# Altium project 智能车_电磁PCB.PrjPcb
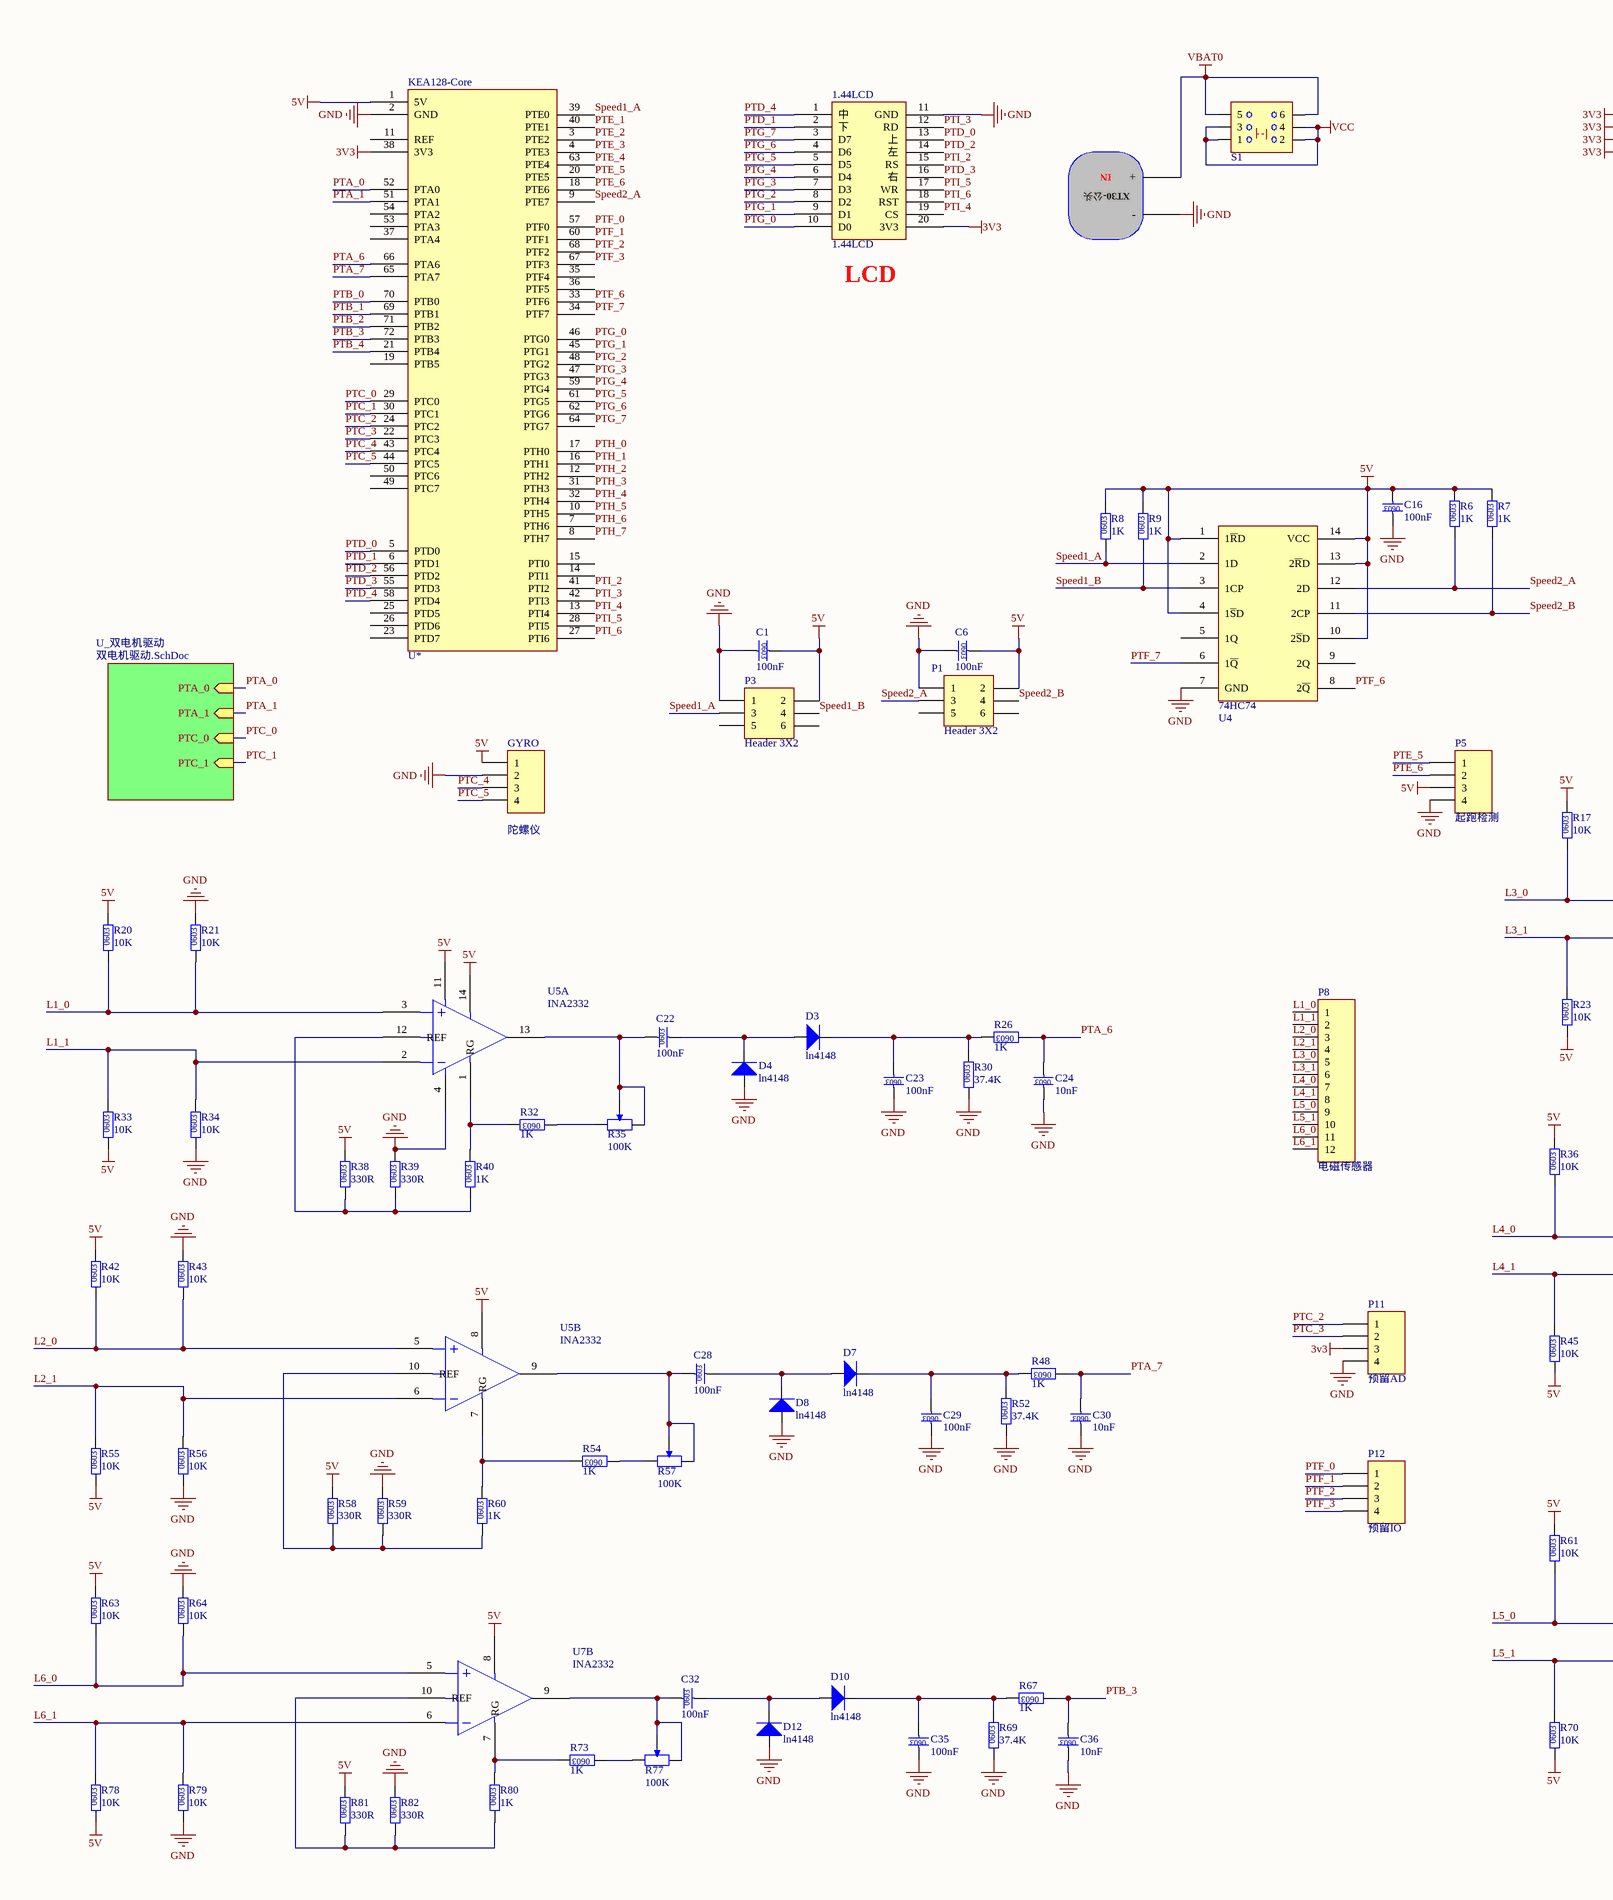
[diagram p0: 电磁PCB.SchDoc, left]
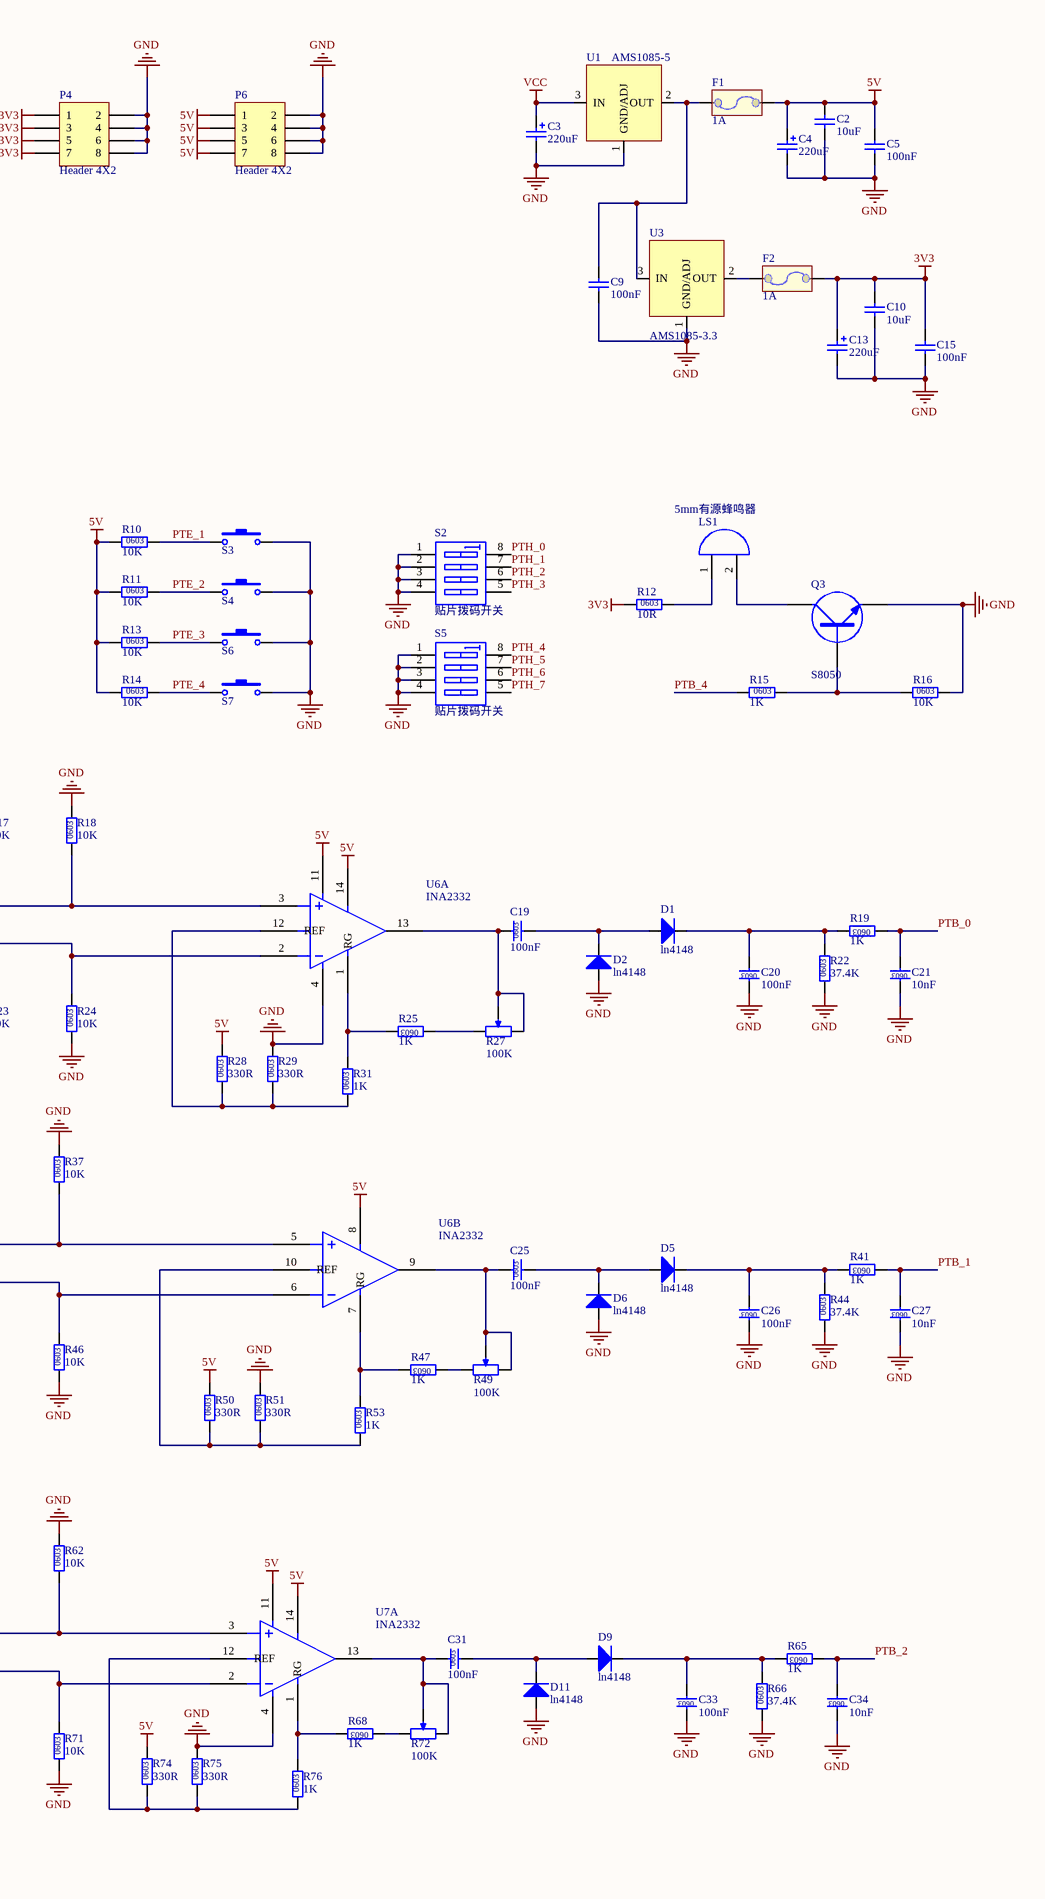
[diagram p1: 电磁PCB.SchDoc, right]
2 sheets, 209 parts. Net scope: hierarchical (ports join the sheet entries above them; power ports are global).
Board file: 电磁PCB.PcbDoc
Sheets:
  电磁PCB.SchDoc
    U_双电机驱动 = 双电机驱动.SchDoc

## Sheet 电磁PCB.SchDoc
size A2

### Parts
1.44LCD  1.44LCD  [1.44LCD]
C1  100nF  [0603C]
C2  10uF  [0805]
C3  220uF  [AEC_D6.3]
C4  220uF  [AEC_D6.3]
C5  100nF  [0805]
C6  100nF  [0603C]
C9  100nF  [0805]
C10  10uF  [0805]
C13  220uF  [AEC_D6.3]
C15  100nF  [0805]
C16  100nF  [0603C]
C19  100nF  [0603C]
C20  100nF  [0603C]
C21  10nF  [0603C]
C22  100nF  [0603C]
C23  100nF  [0603C]
C24  10nF  [0603C]
C25  100nF  [0603C]
C26  100nF  [0603C]
C27  10nF  [0603C]
C28  100nF  [0603C]
C29  100nF  [0603C]
C30  10nF  [0603C]
C31  100nF  [0603C]
C32  100nF  [0603C]
C33  100nF  [0603C]
C34  10nF  [0603C]
C35  100nF  [0603C]
C36  10nF  [0603C]
D1  ln4148  [SOD-523(0603)]
D2  ln4148  [SOD-523(0603)]
D3  ln4148  [SOD-523(0603)]
D4  ln4148  [SOD-523(0603)]
D5  ln4148  [SOD-523(0603)]
D6  ln4148  [SOD-523(0603)]
D7  ln4148  [SOD-523(0603)]
D8  ln4148  [SOD-523(0603)]
D9  ln4148  [SOD-523(0603)]
D10  ln4148  [SOD-523(0603)]
D11  ln4148  [SOD-523(0603)]
D12  ln4148  [SOD-523(0603)]
F1  1A  [1206]
F2  1A  [1206]
GYRO  陀螺仪  [HDR1X4]
KEA128-Core  U*  [山外KEA核心板]
LS1  Bell  [BELL]  (value not drawn)
P1  Header 3X2  [HDR2X3]
P2  XT30-公-pcb  [XT30-垂直]  (value not drawn)
P3  Header 3X2  [HDR2X3]
P4  Header 4X2  [HDR2X4]
P5  起跑检测  [HDR1X4]
P6  Header 4X2  [HDR2X4]
P8  电磁传感器  [HDR1X12]
P11  预留AD  [HDR1X4]
P12  预留IO  [HDR1X4]
Q3  S8050  [SOT-23]
R6  1K  [0603R]
R7  1K  [0603R]
R8  1K  [0603R]
R9  1K  [0603R]
R10  10K  [0603R]
R11  10K  [0603R]
R12  10R  [0603R]
R13  10K  [0603R]
R14  10K  [0603R]
R15  1K  [0603R]
R16  10K  [0603R]
R17  10K  [0603R]
R18  10K  [0603R]
R19  1K  [0603R]
R20  10K  [0603R]
R21  10K  [0603R]
R22  37.4K  [0603R]
R23  10K  [0603R]
R24  10K  [0603R]
R25  1K  [0603R]
R26  1K  [0603R]
R27  100K  [3362P]
R28  330R  [0603R]
R29  330R  [0603R]
R30  37.4K  [0603R]
R31  1K  [0603R]
R32  1K  [0603R]
R33  10K  [0603R]
R34  10K  [0603R]
R35  100K  [3362P]
R36  10K  [0603R]
R37  10K  [0603R]
R38  330R  [0603R]
R39  330R  [0603R]
R40  1K  [0603R]
R41  1K  [0603R]
R42  10K  [0603R]
R43  10K  [0603R]
R44  37.4K  [0603R]
R45  10K  [0603R]
R46  10K  [0603R]
R47  1K  [0603R]
R48  1K  [0603R]
R49  100K  [3362P]
R50  330R  [0603R]
R51  330R  [0603R]
R52  37.4K  [0603R]
R53  1K  [0603R]
R54  1K  [0603R]
R55  10K  [0603R]
R56  10K  [0603R]
R57  100K  [3362P]
R58  330R  [0603R]
R59  330R  [0603R]
R60  1K  [0603R]
R61  10K  [0603R]
R62  10K  [0603R]
R63  10K  [0603R]
R64  10K  [0603R]
R65  1K  [0603R]
R66  37.4K  [0603R]
R67  1K  [0603R]
R68  1K  [0603R]
R69  37.4K  [0603R]
R70  10K  [0603R]
R71  10K  [0603R]
R72  100K  [3362P]
R73  1K  [0603R]
R74  330R  [0603R]
R75  330R  [0603R]
R76  1K  [0603R]
R77  100K  [3362P]
R78  10K  [0603R]
R79  10K  [0603R]
R80  1K  [0603R]
R81  330R  [0603R]
R82  330R  [0603R]
S1  SWITCH  [双排两档6脚]  (value not drawn)
S2  贴片拨码开关  [拨码开关4-2.54间距]
S3  SW-PB  [SMT_BUTTON]  (value not drawn)
S4  SW-PB  [SMT_BUTTON]  (value not drawn)
S5  贴片拨码开关  [拨码开关4-2.54间距]
S6  SW-PB  [SMT_BUTTON]  (value not drawn)
S7  SW-PB  [SMT_BUTTON]  (value not drawn)
U1  AMS1085-5  [LR7843_0]
U3  AMS1085-3.3  [LR7843_0]
U4  74HC74  [TSSOP14]  (value not drawn)
U5  INA2332  [TSSOP14]  (parts A,B of 2)
U6  INA2332  [TSSOP14]  (parts A,B of 2)
U7  INA2332  [TSSOP14]  (parts A,B of 2)

### Sub-sheets
U_双电机驱动 = 双电机驱动.SchDoc: PTA_0 (in), PTA_1 (in), PTC_0 (in), PTC_1 (in)

### Nets
3V3: 1.44LCD.20(3V3) C10.2 C13.1 C15.2 F2.2 KEA128-Core.38(3V3) P4.1 P4.3 P4.5 P4.7 P11.3 R12.1
5V: C1.1 C2.2 C4.1 C5.2 C6.1 C16.2 F1.2 GYRO.1 KEA128-Core.1(5V) P1.2 P3.2 P5.3 P6.1 P6.3 P6.5 P6.7 R6.2 R7.2 R8.2 R9.2 R10.1 R11.1 R13.1 R14.1 R17.2 R20.2 R23.1 R28.2 R33.1 R36.2 R38.2 R42.2 R45.1 R50.2 R55.1 R58.2 R61.2 R63.2 R70.1 R74.2 R78.1 R81.2 U4.1(1~{R}D) U4.4(1~{S}D) U4.10(2~{S}D) U4.13(2~{R}D) U4.14(VCC) U5.8(SHDN) U5.11 U5.14(SHDN) U6.8(SHDN) U6.11 U6.14(SHDN) U7.8(SHDN) U7.11 U7.14(SHDN)
GND: 1.44LCD.11(GND) C1.2 C2.1 C3.2 C4.2 C5.1 C6.2 C9.1 C10.1 C13.2 C15.1 C16.1 C20.1 C21.1 C23.1 C24.1 C26.1 C27.1 C29.1 C30.1 C33.1 C34.1 C35.1 C36.1 D2.1 D4.1 D6.1 D8.1 D11.1 D12.1 GYRO.2 KEA128-Core.2(GND) P1.1 P2.0(-) P3.1 P4.2 P4.4 P4.6 P4.8 P5.4 P6.2 P6.4 P6.6 P6.8 P11.4 Q3.2(E) R16.2 R18.2 R21.2 R22.1 R24.1 R29.2 R30.1 R34.1 R37.2 R39.2 R43.2 R44.1 R46.1 R51.2 R52.1 R56.1 R59.2 R62.2 R64.2 R66.1 R69.1 R71.1 R75.2 R79.1 R82.2 S2.1(A1) S2.2(A2) S2.3(A3) S2.4(A4) S3.2 S4.2 S5.1(A1) S5.2(A2) S5.3(A3) S5.4(A4) S6.2 S7.2 U1.1(GND/ADJ) U3.1(GND/ADJ) U4.7(GND) U5.4 U6.4 U7.4
VBAT0: P2.1(+) S1.5 S1.6
VCC: C3.1 S1.1 S1.2 S1.3 S1.4 U1.3(IN)
L1_0: P8.1 R20.1 R21.1 U5.3
L1_1: P8.2 R33.2 R34.2 U5.2
L2_0: P8.3 R42.1 R43.1 U5.5
L2_1: P8.4 R55.2 R56.2 U5.6
L3_0: P8.5 R17.1 R18.1 U6.3
L3_1: P8.6 R23.2 R24.2 U6.2
L4_0: P8.7 R36.1 R37.1 U6.5
L4_1: P8.8 R45.2 R46.2 U6.6
L5_0: P8.9 R61.1 R62.1 U7.3
L5_1: P8.10 R70.2 R71.2 U7.2
L6_0: P8.11 R63.1 R64.1 U7.5
L6_1: P8.12 R78.2 R79.2 U7.6
PTA_0: KEA128-Core.52(PTA0) ; sheet U_双电机驱动/PTA_0  [project net IN11]
PTA_1: KEA128-Core.51(PTA1) ; sheet U_双电机驱动/PTA_1  [project net IN12]
PTA_6: C24.2 KEA128-Core.66(PTA6) R26.1
PTA_7: C30.2 KEA128-Core.65(PTA7) R48.1
PTB_0: C21.2 KEA128-Core.70(PTB0) R19.1
PTB_1: C27.2 KEA128-Core.69(PTB1) R41.1
PTB_2: C34.2 KEA128-Core.71(PTB2) R65.1
PTB_3: C36.2 KEA128-Core.72(PTB3) R67.1
PTB_4: KEA128-Core.21(PTB4) R15.1
PTC_0: KEA128-Core.29(PTC0) ; sheet U_双电机驱动/PTC_0  [project net IN21]
PTC_1: KEA128-Core.30(PTC1) ; sheet U_双电机驱动/PTC_1  [project net IN22]
PTC_2: KEA128-Core.24(PTC2) P11.1
PTC_3: KEA128-Core.22(PTC3) P11.2
PTC_4: GYRO.3 KEA128-Core.43(PTC4)
PTC_5: GYRO.4 KEA128-Core.44(PTC5)
PTD_0: 1.44LCD.13(上) KEA128-Core.5(PTD0)
PTD_1: 1.44LCD.2(下) KEA128-Core.6(PTD1)
PTD_2: 1.44LCD.14(左) KEA128-Core.56(PTD2)
PTD_3: 1.44LCD.16(右) KEA128-Core.55(PTD3)
PTD_4: 1.44LCD.1(中) KEA128-Core.58(PTD4)
PTE_1: KEA128-Core.40(PTE1) R10.2 S3.1
PTE_2: KEA128-Core.3(PTE2) R11.2 S4.1
PTE_3: KEA128-Core.4(PTE3) R13.2 S6.1
PTE_4: KEA128-Core.63(PTE4) R14.2 S7.1
PTE_5: KEA128-Core.20(PTE5) P5.1
PTE_6: KEA128-Core.18(PTE6) P5.2
PTF_0: KEA128-Core.57(PTF0) P12.1
PTF_1: KEA128-Core.60(PTF1) P12.2
PTF_2: KEA128-Core.68(PTF2) P12.3
PTF_3: KEA128-Core.67(PTF3) P12.4
PTF_6: KEA128-Core.33(PTF6) U4.8(2~{Q})
PTF_7: KEA128-Core.34(PTF7) U4.6(1~{Q})
PTG_0: 1.44LCD.10(D0) KEA128-Core.46(PTG0)
PTG_1: 1.44LCD.9(D1) KEA128-Core.45(PTG1)
PTG_2: 1.44LCD.8(D2) KEA128-Core.48(PTG2)
PTG_3: 1.44LCD.7(D3) KEA128-Core.47(PTG3)
PTG_4: 1.44LCD.6(D4) KEA128-Core.59(PTG4)
PTG_5: 1.44LCD.5(D5) KEA128-Core.61(PTG5)
PTG_6: 1.44LCD.4(D6) KEA128-Core.62(PTG6)
PTG_7: 1.44LCD.3(D7) KEA128-Core.64(PTG7)
PTH_0: KEA128-Core.17(PTH0) S2.8(B1)
PTH_1: KEA128-Core.16(PTH1) S2.7(B2)
PTH_2: KEA128-Core.12(PTH2) S2.6(B3)
PTH_3: KEA128-Core.31(PTH3) S2.5(B4)
PTH_4: KEA128-Core.32(PTH4) S5.8(B1)
PTH_5: KEA128-Core.10(PTH5) S5.7(B2)
PTH_6: KEA128-Core.7(PTH6) S5.6(B3)
PTH_7: KEA128-Core.8(PTH7) S5.5(B4)
PTI_2: 1.44LCD.15(RS) KEA128-Core.41(PTI2)
PTI_3: 1.44LCD.12(RD) KEA128-Core.42(PTI3)
PTI_4: 1.44LCD.19(CS) KEA128-Core.13(PTI4)
PTI_5: 1.44LCD.17(WR) KEA128-Core.28(PTI5)
PTI_6: 1.44LCD.18(RST) KEA128-Core.27(PTI6)
Speed1_A: KEA128-Core.39(PTE0) P3.3 R8.1 U4.2(1D)
Speed1_B: P3.4 R9.1 U4.3(1CP)
Speed2_A: KEA128-Core.9(PTE7) P1.3 R6.1 U4.12(2D)
Speed2_B: P1.4 R7.1 U4.11(2CP)
NetC9_2: C9.2 F1.1 U1.2(OUT) U3.3(IN)
NetC19_1: C19.1 R27.1(TOP) R27.2(TAP) U6.13
NetC19_2: C19.2 D1.1 D2.2
NetC20_2: C20.2 D1.2 R19.2 R22.2
NetC22_1: C22.1 R35.1(TOP) R35.2(TAP) U5.13
NetC22_2: C22.2 D3.1 D4.2
NetC23_2: C23.2 D3.2 R26.2 R30.2
NetC25_1: C25.1 R49.1(TOP) R49.2(TAP) U6.9
NetC25_2: C25.2 D5.1 D6.2
NetC26_2: C26.2 D5.2 R41.2 R44.2
NetC28_1: C28.1 R57.1(TOP) R57.2(TAP) U5.9
NetC28_2: C28.2 D7.1 D8.2
NetC29_2: C29.2 D7.2 R48.2 R52.2
NetC31_1: C31.1 R72.1(TOP) R72.2(TAP) U7.13
NetC31_2: C31.2 D9.1 D11.2
NetC32_1: C32.1 R77.1(TOP) R77.2(TAP) U7.9
NetC32_2: C32.2 D10.1 D12.2
NetC33_2: C33.2 D9.2 R65.2 R66.2
NetC35_2: C35.2 D10.2 R67.2 R69.2
NetF2_1: F2.1 U3.2(OUT)
NetLS1_1: LS1.1(A) R12.2
NetLS1_2: LS1.2(B) Q3.3(C)
NetQ3_1: Q3.1(B) R15.2 R16.1
NetR25_1: R25.1 R27.3(BOT)
NetR25_2: R25.2 R31.2 U6.1(RG)
NetR28_1: R28.1 R29.1 R31.1 U6.12(REF)
NetR32_1: R32.1 R35.3(BOT)
NetR32_2: R32.2 R40.2 U5.1(RG)
NetR38_1: R38.1 R39.1 R40.1 U5.12(REF)
NetR47_1: R47.1 R49.3(BOT)
NetR47_2: R47.2 R53.2 U6.7(RG)
NetR50_1: R50.1 R51.1 R53.1 U6.10(REF)
NetR54_1: R54.1 R57.3(BOT)
NetR54_2: R54.2 R60.2 U5.7(RG)
NetR58_1: R58.1 R59.1 R60.1 U5.10(REF)
NetR68_1: R68.1 R72.3(BOT)
NetR68_2: R68.2 R76.2 U7.1(RG)
NetR73_1: R73.1 R77.3(BOT)
NetR73_2: R73.2 R80.2 U7.7(RG)
NetR74_1: R74.1 R75.1 R76.1 U7.12(REF)
NetR80_1: R80.1 R81.1 R82.1 U7.10(REF)

Not connected (* = marked no-connect by the designer): KEA128-Core 11(REF) 14(PTI1) 15(PTI0) 19(PTB5) 23(PTD7) 25(PTD5) 26(PTD6) 35(PTF4) 36(PTF5) 37(PTA4) 49(PTC7) 50(PTC6) 53(PTA3) 54(PTA2); P1 5 6; P3 5 6; U4 5(1Q) 9(2Q)

### Notes on the sheet
- (near 1.44LCD) LCD
- (in symbol 0603_Cap) 0603
- (in symbol 0603_Res) 0603
- (in symbol Bell) 5mm有源蜂鸣器
- (in symbol XT30-公头) IN

### Library data of the parts
C1 C6 C16 C19-C36 = 0603_Cap: Capacitor
C2 C5 C9 C10 C15 = Cap: Capacitor
C3 C4 C13 = Cap Pol1: Polarized Capacitor (Radial)
D1-D12 = Diode: Typical INFRARED GaAs doide
F1 F2 = Fuse
GYRO P5 P11 P12 = Header 4: Header, 4-Pin; LatestRevisionDate: 17-Jul-2002; LatestRevisionNote: Re-released for DXP Platform.; Publisher: Altium Limited
KEA128-Core = KEA128-Core
P1 P3 = Header 3X2: Header, 3-Pin, Dual row; LatestRevisionDate: 17-Jul-2002; LatestRevisionNote: Re-released for DXP Platform.; Publisher: Altium Limited
P2 = XT30-公头
P4 P6 = Header 4X2: Header, 4-Pin, Dual row; LatestRevisionDate: 17-Jul-2002; LatestRevisionNote: Re-released for DXP Platform.; Publisher: Altium Limited
P8 = Header 12: Header, 12-Pin; LatestRevisionDate: 17-Jul-2002; LatestRevisionNote: Re-released for DXP Platform.; Publisher: Altium Limited
Q3 = NPN: NPN Transistor
R6-R26 R28-R34 R36-R48 R50-R56 R58-R71 R73-R76 R78-R82 = 0603_Res: Resistor
R27 R35 R49 R57 R72 R77 = RPot: Potentiometer
S2 S5 = SW DIP-4: DIP Switch, 4 Position, SPST; Published: 24-Mar-1999; LatestRevisionDate: 29-May-2009; LatestRevisionNote: IPC-7351 Footprint Added.; PackageVersion: Dec-2002; PackageReference: SO8; Publisher: Altium Limited; PackageDescription: 8-Pin Small Outline Integrated Circuit 1.27 mm Pitch; Code_JEDEC: MS-012-AA; Code_IPC: SOIC127P600-8
S3 S4 S6 S7 = SW-PB: Switch
U1 U3 = U22
U5-U7 = INA2332_1
LS1 = Bell: Published: 24-Mar-1999; LatestRevisionDate: 17-Jul-2002; LatestRevisionNote: Re-released for DXP Platform.; PackageReference: PIN2; Publisher: Altium Limited
S1 = SWITCH: LatestRevisionDate: 17-Jul-2002; LatestRevisionNote: Re-released for DXP Platform.; Publisher: Altium Limited

## Sheet 双电机驱动.SchDoc
size A3
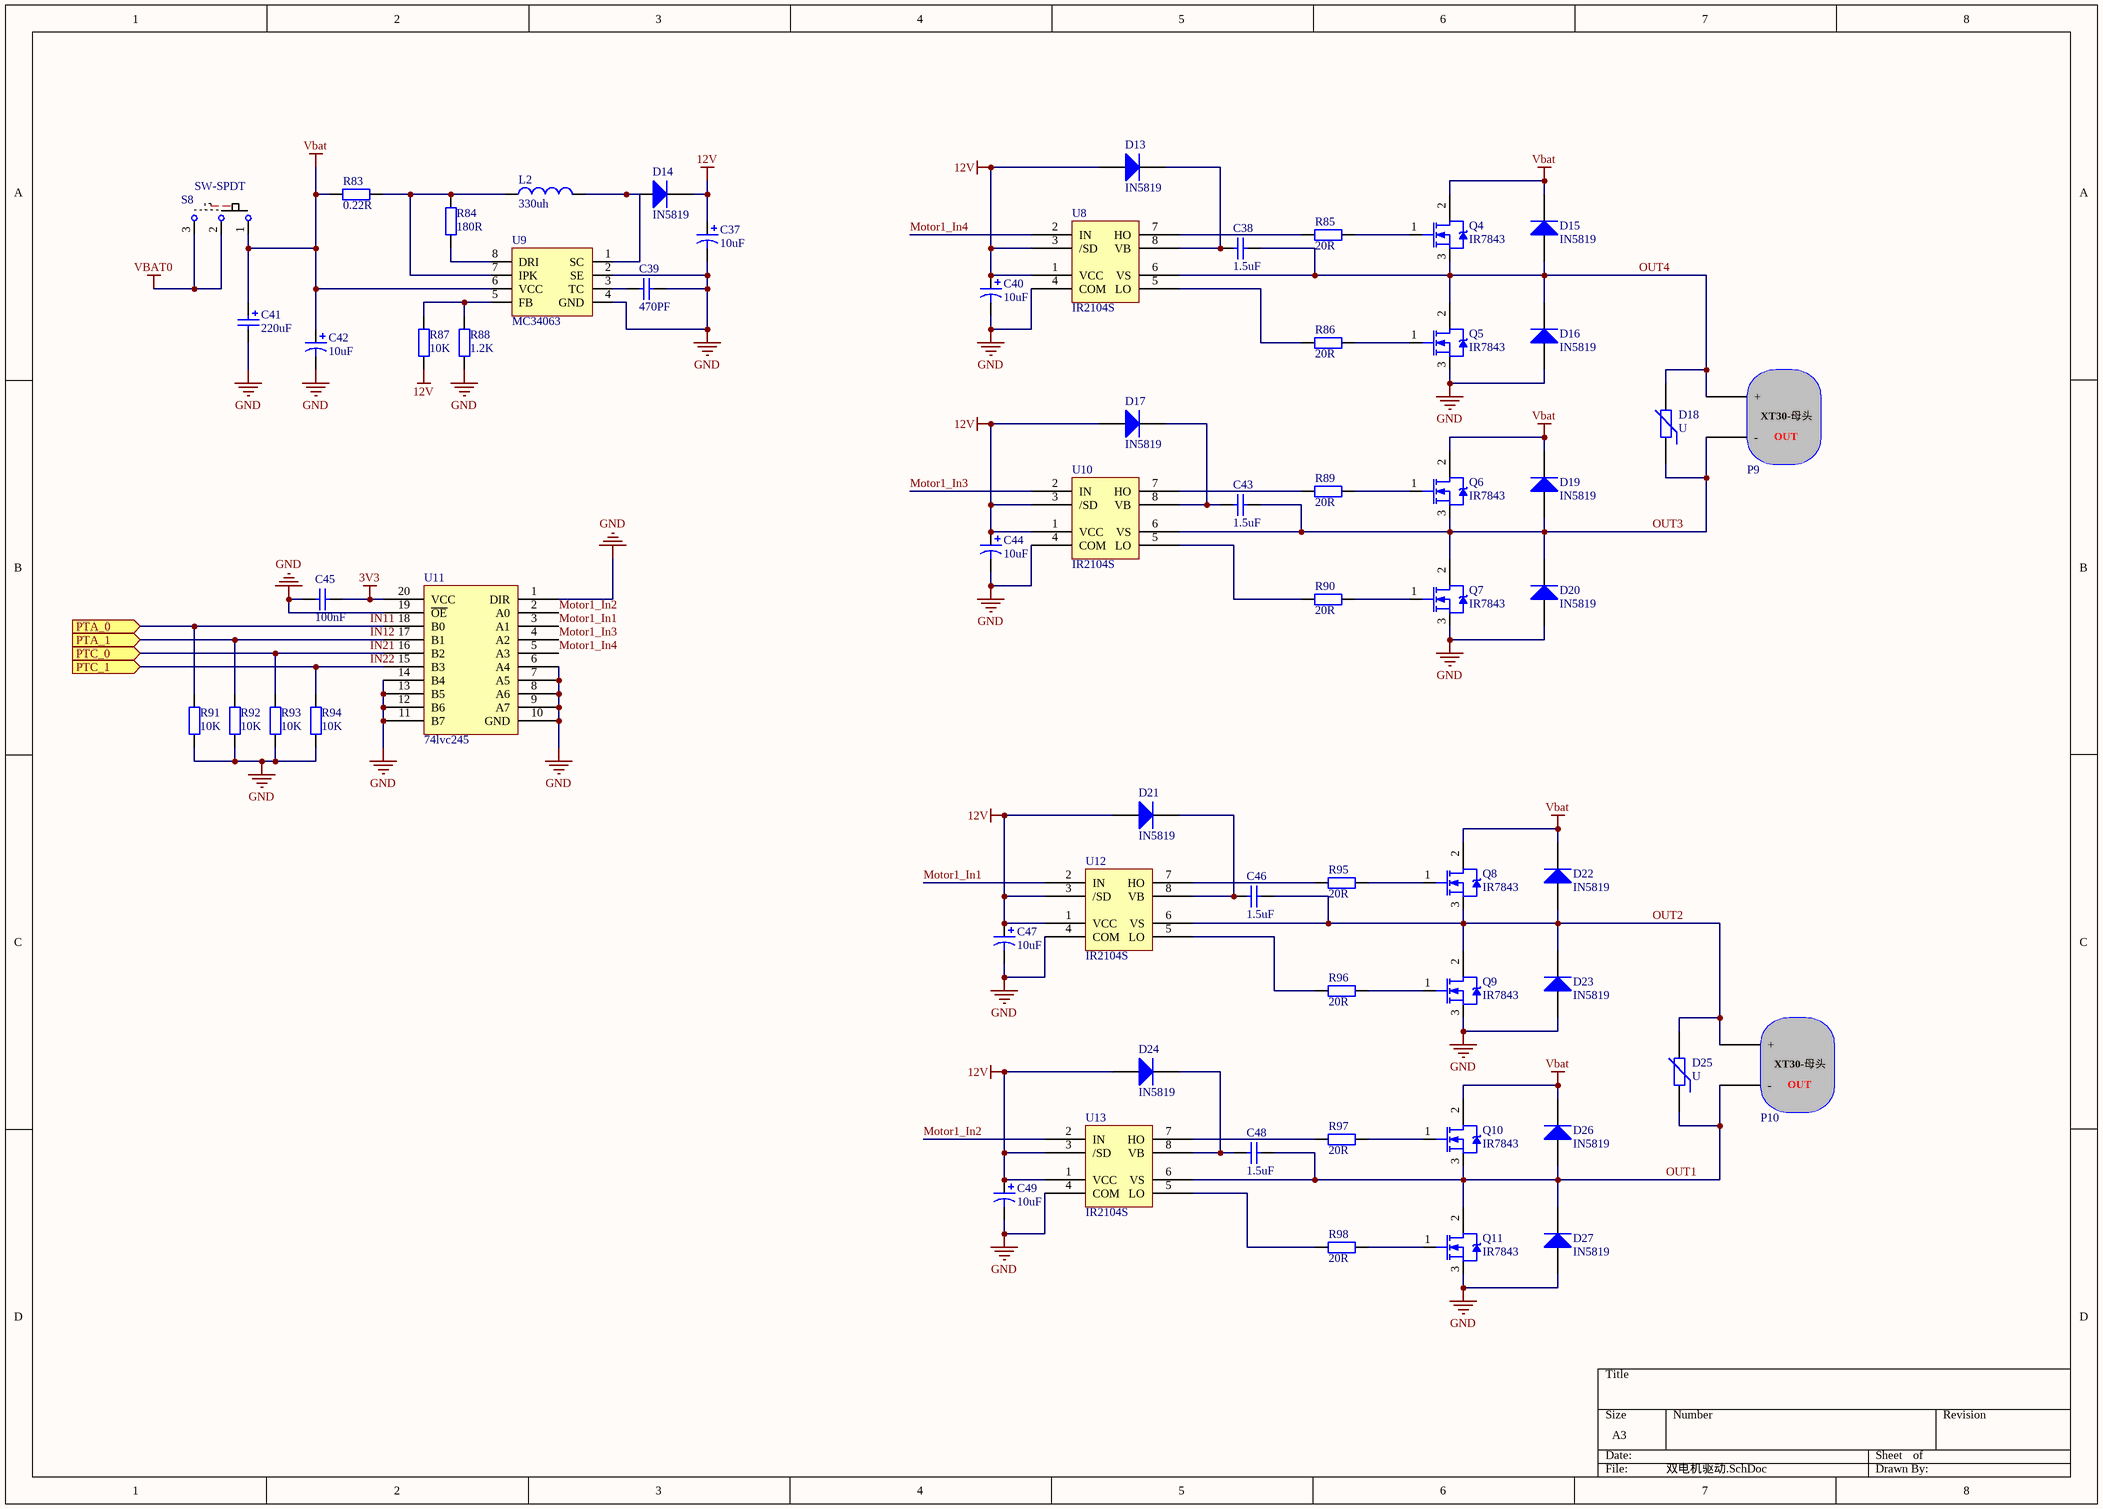
[diagram p2: 双电机驱动.SchDoc]

### Parts
C37  10uF  [1206C]
C38  1.5uF  [0805(2012)]
C39  470PF  [0805(2012)]
C40  10uF  [1206C]
C41  220uF  [AEC_D6.3]
C42  10uF  [1206C]
C43  1.5uF  [0805(2012)]
C44  10uF  [1206C]
C45  100nF  [0805]
C46  1.5uF  [0805(2012)]
C47  10uF  [1206C]
C48  1.5uF  [0805(2012)]
C49  10uF  [1206C]
D13  IN5819  [Diode-1206]
D14  IN5819  [SMB]
D15  IN5819  [SMB]
D16  IN5819  [SMB]
D17  IN5819  [Diode-1206]
D18  U  [0805(2012)]
D19  IN5819  [SMB]
D20  IN5819  [SMB]
D21  IN5819  [Diode-1206]
D22  IN5819  [SMB]
D23  IN5819  [SMB]
D24  IN5819  [Diode-1206]
D25  U  [0805(2012)]
D26  IN5819  [SMB]
D27  IN5819  [SMB]
L2  value 330uh  [电感8*8_0]  (hidden comment: Inductor)
P9  XT30-母-pcb  [XT30-垂直]  (value not drawn)
P10  XT30-母-pcb  [XT30-垂直]  (value not drawn)
Q4  IR7843  [LR7843_0]
Q5  IR7843  [LR7843_0]
Q6  IR7843  [LR7843_0]
Q7  IR7843  [LR7843_0]
Q8  IR7843  [LR7843_0]
Q9  IR7843  [LR7843_0]
Q10  IR7843  [LR7843_0]
Q11  IR7843  [LR7843_0]
R83  0.22R  [0805]
R84  180R  [0805]
R85  20R  [0805]
R86  20R  [0805]
R87  10K  [0805]
R88  1.2K  [0805]
R89  20R  [0805]
R90  20R  [0805]
R91  10K  [0805]
R92  10K  [0805]
R93  10K  [0805]
R94  10K  [0805]
R95  20R  [0805]
R96  20R  [0805]
R97  20R  [0805]
R98  20R  [0805]
S8  SW-SPDT  [SWICH_2]
U8  IR2104S  [IR2104]
U9  MC34063  [MC34063]
U10  IR2104S  [IR2104]
U11  74lvc245  [74lvc245 TSSOP]
U12  IR2104S  [IR2104]
U13  IR2104S  [IR2104]

### Ports
PTA_0 (in), PTA_1 (in), PTC_0 (in), PTC_1 (in)

### Nets
3V3: C45.2 U11.20(VCC)
12V: C37.1 C40.1 C44.1 C47.1 C49.1 D13.1(A) D14.2(K) D17.1(A) D21.1(A) D24.1(A) R87.2 U8.1(VCC) U8.3(/SD) U10.1(VCC) U10.3(/SD) U12.1(VCC) U12.3(/SD) U13.1(VCC) U13.3(/SD)
GND: C37.2 C39.1 C40.2 C41.2 C42.2 C44.2 C45.1 C47.2 C49.2 D16.1(A) D20.1(A) D23.1(A) D27.1(A) Q5.3(S) Q7.3(S) Q9.3(S) Q11.3(S) R88.2 R91.1 R92.1 R93.1 R94.1 U8.4(COM) U9.2(SE) U9.4(GND) U10.4(COM) U11.1(DIR) U11.6(A4) U11.7(A5) U11.8(A6) U11.9(A7) U11.10(GND) U11.11(B7) U11.12(B6) U11.13(B5) U11.14(B4) U11.19(~{OE}) U12.4(COM) U13.4(COM)
Vbat: C41.1 C42.1 D15.2(K) D19.2(K) D22.2(K) D26.2(K) Q4.2(D) Q6.2(D) Q8.2(D) Q10.2(D) R83.2 S8.1 U9.6(VCC)
VBAT0: S8.2 S8.3
IN11: R91.2 U11.18(B0) ; port PTA_0
IN12: R92.2 U11.17(B1) ; port PTA_1
IN21: R93.2 U11.16(B2) ; port PTC_0
IN22: R94.2 U11.15(B3) ; port PTC_1
Motor1_In1: U11.3(A1) U12.2(IN)
Motor1_In2: U11.2(A0) U13.2(IN)
Motor1_In3: U10.2(IN) U11.4(A2)
Motor1_In4: U8.2(IN) U11.5(A3)
OUT1: C48.2 D25.1 D26.1(A) D27.2(K) P10.1(-) Q10.3(S) Q11.2(D) U13.6(VS)
OUT2: C46.2 D22.1(A) D23.2(K) D25.2 P10.0(+) Q8.3(S) Q9.2(D) U12.6(VS)
OUT3: C43.2 D18.1 D19.1(A) D20.2(K) P9.1(-) Q6.3(S) Q7.2(D) U10.6(VS)
OUT4: C38.2 D15.1(A) D16.2(K) D18.2 P9.0(+) Q4.3(S) Q5.2(D) U8.6(VS)
NetC38_1: C38.1 D13.2(K) U8.8(VB)
NetC39_2: C39.2 U9.3(TC)
NetC43_1: C43.1 D17.2(K) U10.8(VB)
NetC46_1: C46.1 D21.2(K) U12.8(VB)
NetC48_1: C48.1 D24.2(K) U13.8(VB)
NetD14_1: D14.1(A) L2.2 U9.1(SC)
NetL2_1: L2.1 R83.1 R84.2 U9.7(IPK)
NetQ4_1: Q4.1(G) R85.2
NetQ5_1: Q5.1(G) R86.2
NetQ6_1: Q6.1(G) R89.2
NetQ7_1: Q7.1(G) R90.2
NetQ8_1: Q8.1(G) R95.2
NetQ9_1: Q9.1(G) R96.2
NetQ10_1: Q10.1(G) R97.2
NetQ11_1: Q11.1(G) R98.2
NetR84_1: R84.1 U9.8(DRI)
NetR85_1: R85.1 U8.7(HO)
NetR86_1: R86.1 U8.5(LO)
NetR87_1: R87.1 R88.1 U9.5(FB)
NetR89_1: R89.1 U10.7(HO)
NetR90_1: R90.1 U10.5(LO)
NetR95_1: R95.1 U12.7(HO)
NetR96_1: R96.1 U12.5(LO)
NetR97_1: R97.1 U13.7(HO)
NetR98_1: R98.1 U13.5(LO)

### Notes on the sheet
- (in symbol XT30-母头) OUT

### Library data of the parts
C37 C40-C42 C44 C47 C49 = Cap Pol1: Polarized Capacitor (Radial)
  C37 C40 C42 C44 C47 C49: Published: 8-Jun-2000; LatestRevisionDate: 17-Jul-2002; LatestRevisionNote: Re-released for DXP Platform.; PackageReference: RB7.6-15; Publisher: Altium Limited; PackageDescription: Polarized Capacitor (Radial); 2 Leads; Value: 10uF
C38 C39 C43 C45 C46 C48 = Cap: Capacitor
  C38 C43 C46 C48: Published: 8-Jun-2000; LatestRevisionDate: 17-Jul-2002; LatestRevisionNote: Re-released for DXP Platform.; PackageReference: RAD-0.3; Publisher: Altium Limited; PackageDescription: Radial Cap, Thru-Hole; 2 Leads; 0.3 in Pin Spacing; Value: 1.5uF
  C39: Published: 8-Jun-2000; LatestRevisionDate: 17-Jul-2002; LatestRevisionNote: Re-released for DXP Platform.; PackageReference: RAD-0.3; Publisher: Altium Limited; PackageDescription: Radial Cap, Thru-Hole; 2 Leads; 0.3 in Pin Spacing; Value: 470PF
D13-D17 D19-D24 D26 D27 = Diode: Default Diode; PackageVersion: Sep-1996; PackageDescription: DO-214-AB/SMC; 2 C-Bend Leads; Body 7.9 x 5.9 mm, inc. leads (LxW); Code_JEDEC: DO-214-AB
D18 D25 = Res Varistor: Varistor (Voltage-Sensitive Resistor); Published: 24-Mar-1999; LatestRevisionDate: 29-May-2009; LatestRevisionNote: IPC-7351 Footprint Added.; PackageVersion: Mar-2003; PackageReference: 6-0805; Publisher: Altium Limited; PackageDescription: Chip Resistor 0805 Case Size; Code_IPC: RESC2012
L2 = Inductor: Code_IEC: 1005; Published: 8-Jun-2000; LatestRevisionDate: 29-May-2009; LatestRevisionNote: IPC-7351 Footprint Added.; PackageReference: 0402-A; Publisher: Altium Limited; PackageDescription: Chip Inductor; Code_JEITA: 0402
P9 P10 = XT30-母头
Q4-Q11 = NMOS-2: N-Channel Power MOSFET; Note: Pin 2 is electrically connected to pin 4.; Published: 8-Jun-2000; LatestRevisionDate: 17-Jul-2002; LatestRevisionNote: Re-released for DXP Platform.; DatasheetVersion: PD-9.814; PackageVersion: Feb-1997; PackageReference: TO-220AB; Publisher: Altium Limited; PackageDescription: TO, Thru-Hole, Vertical, Heatsink Mounted; 3 In-Line Leads; Pitch 2.54 mm; ComponentLink1Description: Manufacturer Link; ComponentLink1URL: http://www.irf.com/
R83-R98 = Res: Resistor
S8 = SW-SPDT: SPDT Subminiature Toggle Switch, Right Angle Mounting, Vertical Actuation
U8 U10 U12 U13 = Component_1_1
U9 = 74HC00
U11 = 74lvc245: 8位5伏转3.3伏电平转换芯片

## Nets that join several sheets
3V3: 电磁PCB (12 pins), 双电机驱动 (C45.2 U11.20)
GND: 电磁PCB (89 pins), 双电机驱动 (39 pins)
VBAT0: 电磁PCB (P2.1 S1.5 S1.6), 双电机驱动 (S8.2 S8.3)
IN11: 电磁PCB (KEA128-Core.52), 双电机驱动 (R91.2 U11.18)
IN12: 电磁PCB (KEA128-Core.51), 双电机驱动 (R92.2 U11.17)
IN21: 电磁PCB (KEA128-Core.29), 双电机驱动 (R93.2 U11.16)
IN22: 电磁PCB (KEA128-Core.30), 双电机驱动 (R94.2 U11.15)